# Altium schematic sheet ESP12_DEV_01.SchDoc: ESP12_DEV
size A3; Date: 18/08/2015; DrawnBy: Wim Van Gool; Revision: 01; SheetNumber: 1; SheetTotal: 1; PageSetup: Record=PageOptions|CenterHorizontal=True|CenterVertical=True|PrintScale=0.70|XCorrection=1.00|YCorrection=1.00|PrintKind=1|BorderSize=5000000|LeftOffset=0|BottomOffset=0|Orientation=2|PaperLength=1000|PaperWidth=1000|Scale=100|PaperSource=15|PrintQuality=600|MediaType=1|DitherType=10|PrintScaleMode=1|PaperKind=A4 (210 x 297 mm)|PaperIndex=9
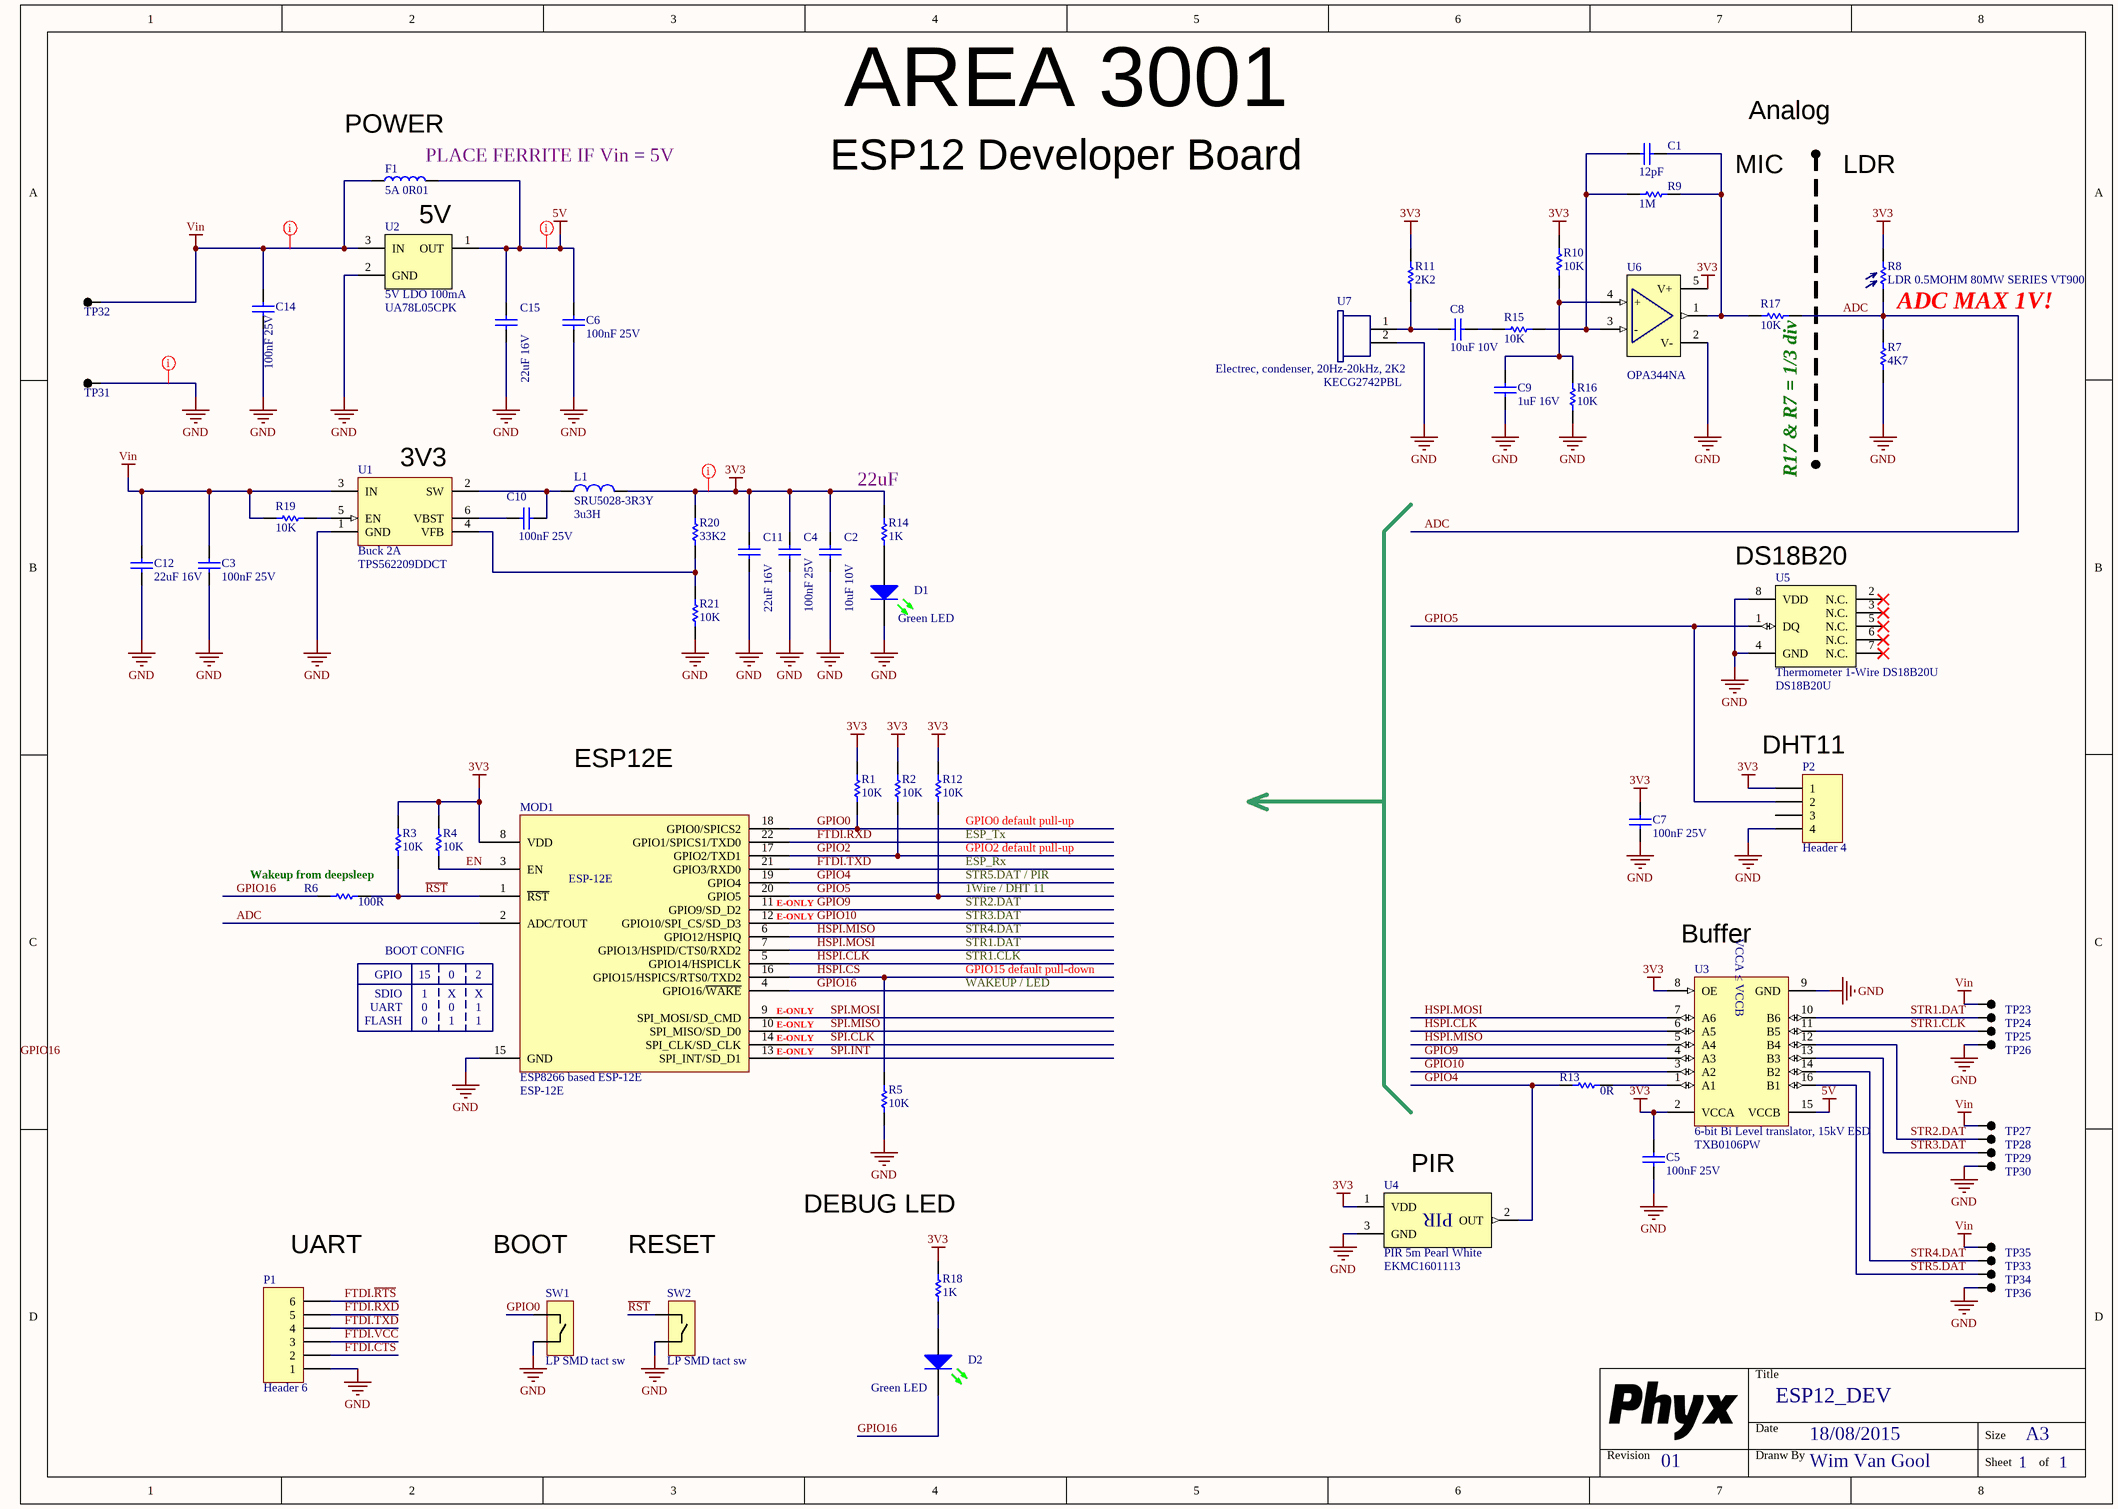
[diagram p0: ESP12_DEV_01.SchDoc]

## Parts
C1  value 12pF  [C0603]  (hidden comment: CAP_CERAMIC)
C2  value 10uF 10V  [C0805]  (hidden comment: CAP_CERAMIC)
C3  value 100nF 25V  [C0805]  (hidden comment: CAP_CERAMIC)
C4  value 100nF 25V  [C0805]  (hidden comment: CAP_CERAMIC)
C5  value 100nF 25V  [C0805]  (hidden comment: CAP_CERAMIC)
C6  value 100nF 25V  [C0805]  (hidden comment: CAP_CERAMIC)
C7  value 100nF 25V  [C0805]  (hidden comment: CAP_CERAMIC)
C8  value 10uF 10V  [C0805]  (hidden comment: CAP_CERAMIC)
C9  value 1uF 16V  [C0603]  (hidden comment: CAP_CERAMIC)
C10  value 100nF 25V  [C0805]  (hidden comment: CAP_CERAMIC)
C11  value 22uF 16V  [C1206]  (hidden comment: CAP_CERAMIC)
C12  value 22uF 16V  [C1206]  (hidden comment: CAP_CERAMIC)
C14  value 100nF 25V  [C0805]  (hidden comment: CAP_CERAMIC)
C15  value 22uF 16V  [C1206]  (hidden comment: CAP_CERAMIC)
D1  Green LED  [LED_0805_GR]
D2  Green LED  [LED_0805_GR]
F1  value 5A 0R01  [L0805]  (hidden comment: FERRITE)
L1  SRU5028-3R3Y  value 3u3H  [BRNS_SRU5028]
MOD1  ESP8266 based ESP-12E  value ESP-12E  [ESP-12E]
P1  Header 6  [HDR1X6]
P2  Header 4  [HDR1X4]
R1  value 10K  [R0603]  (hidden comment: RESISTOR)
R2  value 10K  [R0603]  (hidden comment: RESISTOR)
R3  value 10K  [R0603]  (hidden comment: RESISTOR)
R4  value 10K  [R0603]  (hidden comment: RESISTOR)
R5  value 10K  [R0603]  (hidden comment: RESISTOR)
R6  value 100R  [R0603]  (hidden comment: RESISTOR)
R7  value 4K7  [R0603]  (hidden comment: RESISTOR)
R8  LDR 0.5MOHM 80MW SERIES VT900  [VT900]
R9  value 1M  [R0603]  (hidden comment: RESISTOR)
R10  value 10K  [R0603]  (hidden comment: RESISTOR)
R11  value 2K2  [R0603]  (hidden comment: RESISTOR)
R12  value 10K  [R0603]  (hidden comment: RESISTOR)
R13  value 0R  [R0603]  (hidden comment: RESISTOR)
R14  value 1K  [R0603]  (hidden comment: RESISTOR)
R15  value 10K  [R0603]  (hidden comment: RESISTOR)
R16  value 10K  [R0603]  (hidden comment: RESISTOR)
R17  value 10K  [R0603]  (hidden comment: RESISTOR)
R18  value 1K  [R0603]  (hidden comment: RESISTOR)
R19  value 10K  [R0603]  (hidden comment: RESISTOR)
R20  value 33K2  [R0603]  (hidden comment: RESISTOR)
R21  value 10K  [R0603]  (hidden comment: RESISTOR)
SW1  LP SMD tact sw  [CK_KMR4]
SW2  LP SMD tact sw  [CK_KMR4]
TP23  TEST_PAD  [TP_2x3mm]  (value not drawn)
TP24  TEST_PAD  [TP_2x3mm]  (value not drawn)
TP25  TEST_PAD  [TP_2x3mm]  (value not drawn)
TP26  TEST_PAD  [TP_2x3mm]  (value not drawn)
TP27  TEST_PAD  [TP_2x3mm]  (value not drawn)
TP28  TEST_PAD  [TP_2x3mm]  (value not drawn)
TP29  TEST_PAD  [TP_2x3mm]  (value not drawn)
TP30  TEST_PAD  [TP_2x3mm]  (value not drawn)
TP31  TEST_PAD  [TP_2x3mm]  (value not drawn)
TP32  TEST_PAD  [TP_2x3mm]  (value not drawn)
TP33  TEST_PAD  [TP_2x3mm]  (value not drawn)
TP34  TEST_PAD  [TP_2x3mm]  (value not drawn)
TP35  TEST_PAD  [TP_2x3mm]  (value not drawn)
TP36  TEST_PAD  [TP_2x3mm]  (value not drawn)
U1  Buck 2A  value TPS562209DDCT  [TI_DDC_R-PDSO-G6]
U2  5V LDO 100mA  value UA78L05CPK  [TI_PK]
U3  6-bit Bi Level translator, 15kV ESD  value TXB0106PW  [TI_PW_R-PDSO-G16]
U4  PIR 5m Pearl White  value EKMC1601113  [PAN_EKMC1601113]
U5  Thermometer 1-Wire DS18B20U  value DS18B20U  [MAX_uSOP8]
U6  value OPA344NA  [TI_DBV_R-PDSO-G5]  (hidden comment: Low Power, Single supply, Rail-to-Rail opamp)
U7  Electrec, condenser, 20Hz-20kHz, 2K2  value KECG2742PBL  [MIC_2742PB]

## Nets
3V3: C2.1 C4.1 C5.1 C7.1 C11.1 L1.2 MOD1.8(VDD) P2.1 R1.1 R2.1 R3.1 R4.1 R8.1 R10.2 R11.1 R12.1 R14.1 R18.1 R20.1 U3.2(VCCA) U3.8(OE) U4.1(VDD) U6.5(V+)
5V: C6.1 C15.1 F1.2 U2.1(OUT) U3.15(VCCB)
GND: C2.2 C3.2 C4.2 C5.2 C6.2 C7.2 C9.2 C11.2 C12.2 C14.1 C15.2 D1.2(K) MOD1.15(GND) P1.1 P2.4 R5.2 R7.2 R16.1 R21.1 SW1.2 SW2.2 TP26.1 TP30.1 TP31.1 TP36.1 U1.1(GND) U2.2(GND) U3.9(GND) U4.3(GND) U5.4(GND) U5.8(VDD) U6.2(V-) U7.2
Vin: C3.1 C12.1 C14.2 F1.1 R19.2 TP23.1 TP27.1 TP32.1 TP35.1 U1.3(IN) U2.3(IN)
ADC: MOD1.2(ADC/TOUT) R7.1 R8.2 R17.1
EN: MOD1.3(EN) R4.2
FTDI.~{CTS}: P1.2
FTDI.~{RTS}: P1.6
FTDI.RXD: MOD1.22(GPIO1/SPICS1/TXD0) P1.5
FTDI.TXD: MOD1.21(GPIO3/RXD0) P1.4
FTDI.VCC: P1.3
GPIO0: MOD1.18(GPIO0/SPICS2) R1.2 SW1.1
GPIO2: MOD1.17(GPIO2/TXD1) R2.2
GPIO4: MOD1.19(GPIO4) R13.2 U4.2(OUT)
GPIO5: MOD1.20(GPIO5) P2.2 R12.2 U5.1(DQ)
GPIO9: MOD1.11(GPIO9/SD_D2) U3.4(A3)
GPIO10: MOD1.12(GPIO10/SPI_CS/SD_D3) U3.3(A2)
GPIO16: D2.2(K) MOD1.4(GPIO16/~{WAKE}) R6.2
HSPI.CLK: MOD1.5(GPIO14/HSPICLK) U3.6(A5)
HSPI.CS: MOD1.16(GPIO15/HSPICS/RTS0/TXD2) R5.1
HSPI.MISO: MOD1.6(GPIO12/HSPIQ) U3.5(A4)
HSPI.MOSI: MOD1.7(GPIO13/HSPID/CTS0/RXD2) U3.7(A6)
~{RST}: MOD1.1(~{RST}) R3.2 R6.1 SW2.1
SPI.CLK: MOD1.14(SPI_CLK/SD_CLK)
SPI.INT: MOD1.13(SPI_INT/SD_D1)
SPI.MISO: MOD1.10(SPI_MISO/SD_D0)
SPI.MOSI: MOD1.9(SPI_MOSI/SD_CMD)
STR1.CLK: TP25.1 U3.11(B5)
STR1.DAT: TP24.1 U3.10(B6)
STR2.DAT: TP28.1 U3.12(B4)
STR3.DAT: TP29.1 U3.13(B3)
STR4.DAT: TP33.1 U3.14(B2)
STR5.DAT: TP34.1 U3.16(B1)
NetC1_1: C1.1 R9.1 R17.2 U6.1(OUT)
NetC1_2: C1.2 R9.2 R15.1 U6.3(-)
NetC8_1: C8.1 R15.2
NetC8_2: C8.2 R11.2 U7.1
NetC9_1: C9.1 R10.1 R16.2 U6.4(+)
NetC10_1: C10.1 L1.1 U1.2(SW)
NetC10_2: C10.2 U1.6(VBST)
NetD1_1: D1.1(A) R14.2
NetD2_1: D2.1(A) R18.2
NetR13_1: R13.1 U3.1(A1)
NetR19_1: R19.1 U1.5(EN)
NetR20_2: R20.2 R21.2 U1.4(VFB)

Not connected (* = marked no-connect by the designer): P2 3; U5 2(N.C.)* 3(N.C.)* 5(N.C.)* 6(N.C.)* 7(N.C.)*

## Layout directives
net class POWER: 3V3, 5V, GND, Vin

## Notes on the sheet
- (near F1) POWER
- (near F1) PLACE FERRITE IF Vin = 5V
- AREA 3001
- ESP12 Developer Board
- MIC
- Analog
- LDR
- 5V
- (near R8) ADC MAX 1V!
- (near U1) 3V3
- (near R14) 22uF
- (near R17) R17 & R7 = 1/3 div
- (near U5) DS18B20
- ESP12E
- (near P2) DHT11
- (near R12) GPIO0 default pull-up
- (near R12) GPIO2 default pull-up
- (near R12) ESP_Tx
- (near R6) Wakeup from deepsleep
- (near MOD1) E-ONLY
- STR2.DAT
- STR3.DAT
- 1Wire / DHT 11
- STR5.DAT / PIR
- ESP_Rx
- GPIO
- SDIO
- 15
- 1
- BOOT CONFIG
- 0
- X
- (near MOD1) 2
- (near MOD1) X
- GPIO15 default pull-down
- STR1.DAT
- STR1.CLK
- STR4.DAT
- WAKEUP / LED
- (near U3) Buffer
- UART
- FLASH
- (near MOD1) 1
- (near U4) PIR
- (near P1) UART
- BOOT
- RESET
- DEBUG LED
- Title
- Revision
- Date
- Dranw By
- Size
- A3
- Sheet
- of
- Labels drawn without touching a wire or pin: GPIO16
- (in symbol LVL # 6ch TXB0104PW) VCCA ≤ VCCB
- (in symbol PIR 5m PW EKMC1601113) PIR

## Library data of the parts
C1 = CAP # 12pF 50V 0402: Capacitor Ceramic; Supplier 1: Farnell; Supplier Part Number 1: 2310489
C2 C8 = CAP # 10uF 10V 0805: Capacitor Ceramic; Supplier 1: Farnell; Supplier Part Number 1: 2320859
C3-C7 C10 C14 = CAP # 100nF 25V 0805: Capacitor Ceramic; Supplier 1: Farnell; Supplier Part Number 1: 1856468
C9 = CAP # 1uF 16V 0603: Capacitor Ceramic; Supplier 1: Farnell; Supplier Part Number 1: 2320814
C11 C12 C15 = CAP # 22uF 16V 1206 X5R: Capacitor Ceramic; Supplier 1: Farnell; Supplier Part Number 1: 2320923
D1 D2 = LED # Green 0805: =Description; Supplier 1: Farnell; Supplier Part Number 1: 2099239
F1 = FER # 80R 5A 0805 0R01: Supplier 1: Farnell; Supplier Part Number 1: 2292366
L1 = IND # 3u3H 5.2x5.2mm: Supplier 1: Farnell; Supplier Part Number 1: 1362085
MOD1 = WiFi # MOD ESP-12E: =Description
P1 = Pin Header 2.54mm 6way
P2 = Pin Header 2.54mm 4way
R1-R5 R10 R12 R15-R17 R19 R21 = RES # 10K 0603
R6 = RES # 100R 0603
R7 = RES # 4K7 0603
R8 = LDR VT90N2: =Description; Value: VT90N2; Supplier 1: Farnell; Supplier Part Number 1: 1652637
R9 = RES # 1M 0603
R11 = RES # 2K2 0603
R13 = RES # 0R 0603
R14 R18 = RES # 1K 0603
R20 = RES # 33K2 0603: Supplier 1: Farnell; Supplier Part Number 1: 2331150
SW1 SW2 = SW # KMR4: Value: KMR442GULCLFS; Supplier 1: Farnell
TP23-TP36 = TP # 2x3mm: Value: NO BOM
U1 = PWR # Buck TPS562209 2A: =Description; Supplier 1: Farnell; Supplier Part Number 1: 2420236
U2 = LDO # 5V 100mA: LDO 5V 100mA; Supplier 1: Farnell; Supplier Part Number 1: 2112604
U3 = LVL # 6ch TXB0104PW: =Description; Supplier 1: Farnell
U4 = PIR 5m PW EKMC1601113: =Description; Supplier 1: Farnell; Supplier Part Number 1: 2095730
U5 = TMP # DS18B20U: =Description; Supplier 1: Farnell; Supplier Part Number 1: 1379725
U6 = OP # OPA344: =Description; Supplier 1: Farnell; Supplier Part Number 1: 1234969
U7 = MIC ELEC KECG2742PBL: =Description; Supplier 1: Farnell; Supplier Part Number 1: 1502742